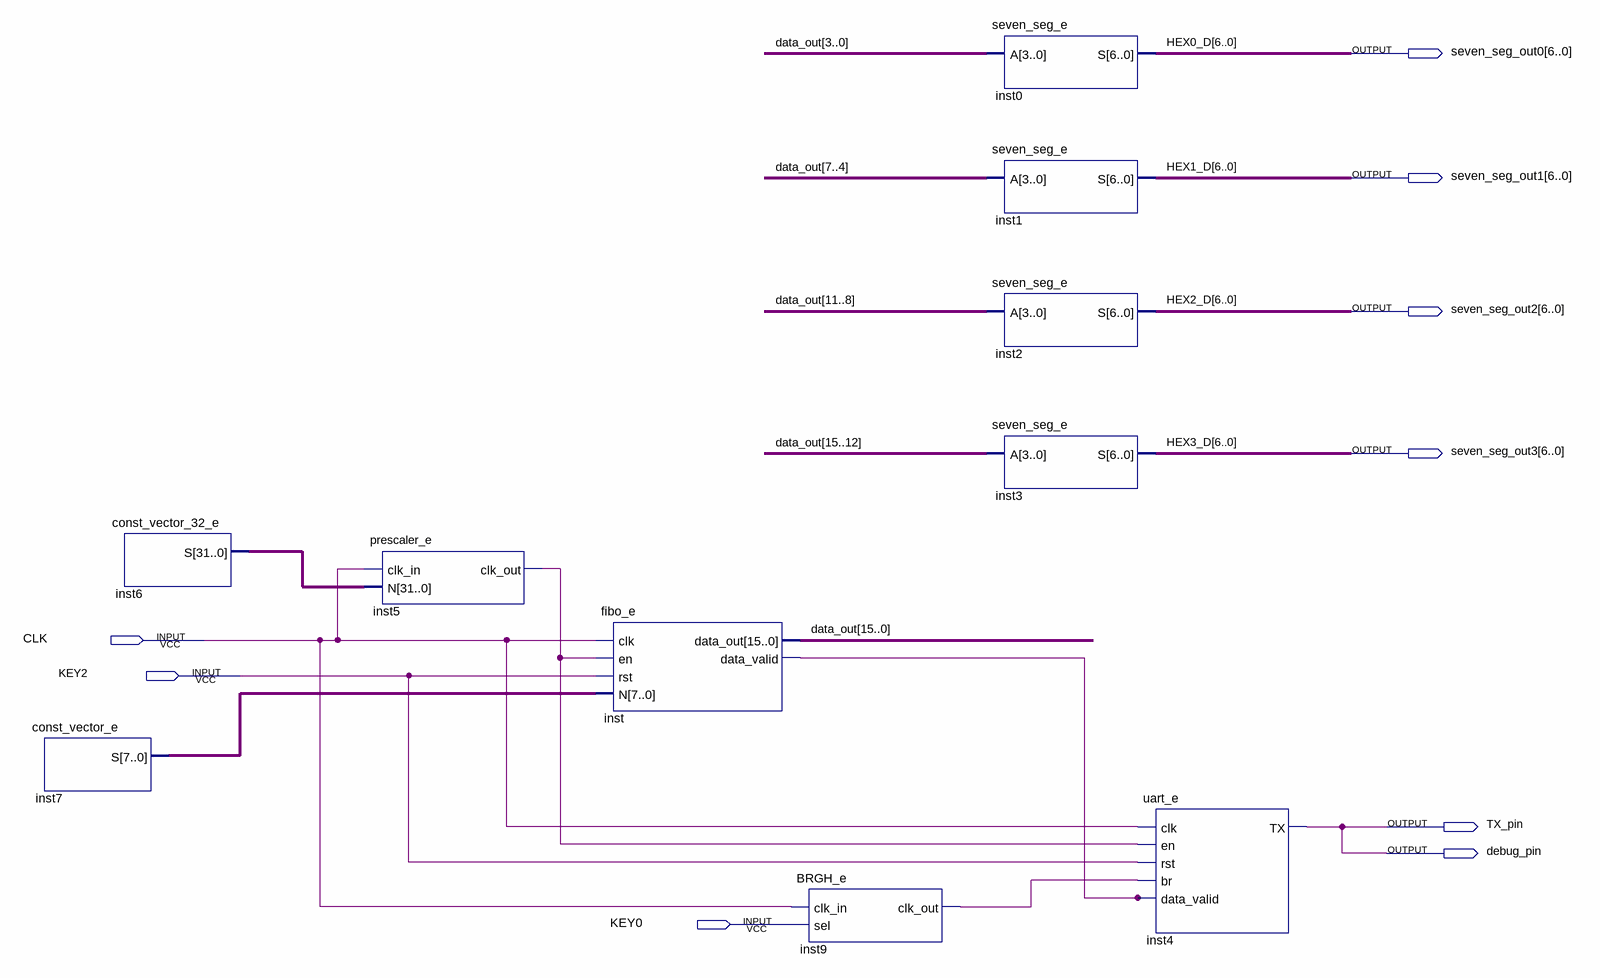
[diagram p0: schematic sheet]
// Quartus schematic TP_elec_num.bdf as structural Verilog: 10 symbols, 9 pins
module TP_elec_num (
  input  CLK,
  input  KEY2,
  input  KEY0,
  output [6:0] seven_seg_out0,
  output [6:0] seven_seg_out1,
  output [6:0] seven_seg_out2,
  output [6:0] seven_seg_out3,
  output TX_pin,
  output debug_pin
);

  wire inst5_clk_out, inst9_clk_out, inst_data_valid;
  wire [7:0] inst7_s;
  wire [15:0] data_out;
  wire [31:0] inst6_s;

  const_vector_e inst7 (.S(inst7_s));
  const_vector_32_e inst6 (.S(inst6_s));
  prescaler_e inst5 (.clk_in(CLK), .N(inst6_s), .clk_out(inst5_clk_out));
  fibo_e inst (
    .clk(CLK), .en(inst5_clk_out), .rst(KEY2), .N(inst7_s), .data_out(data_out), .data_valid(inst_data_valid));
  BRGH_e inst9 (.clk_in(CLK), .sel(KEY0), .clk_out(inst9_clk_out));
  seven_seg_e inst0 (.A(data_out[3:0]), .S(seven_seg_out0));
  seven_seg_e inst1 (.A(data_out[7:4]), .S(seven_seg_out1));
  seven_seg_e inst2 (.A(data_out[11:8]), .S(seven_seg_out2));
  seven_seg_e inst3 (.A(data_out[15:12]), .S(seven_seg_out3));
  uart_e inst4 (
    .clk(CLK), .en(inst5_clk_out), .rst(KEY2), .br(inst9_clk_out), .data_valid(inst_data_valid),
    .TX(debug_pin));

  assign TX_pin = debug_pin;

  // Other names for the same wires on the sheet: HEX0_D[6:0] = seven_seg_out0; HEX1_D[6:0] = seven_seg_out1;
  //   HEX2_D[6:0] = seven_seg_out2; HEX3_D[6:0] = seven_seg_out3
endmodule
